# Altium project Sensor1.PrjPcb
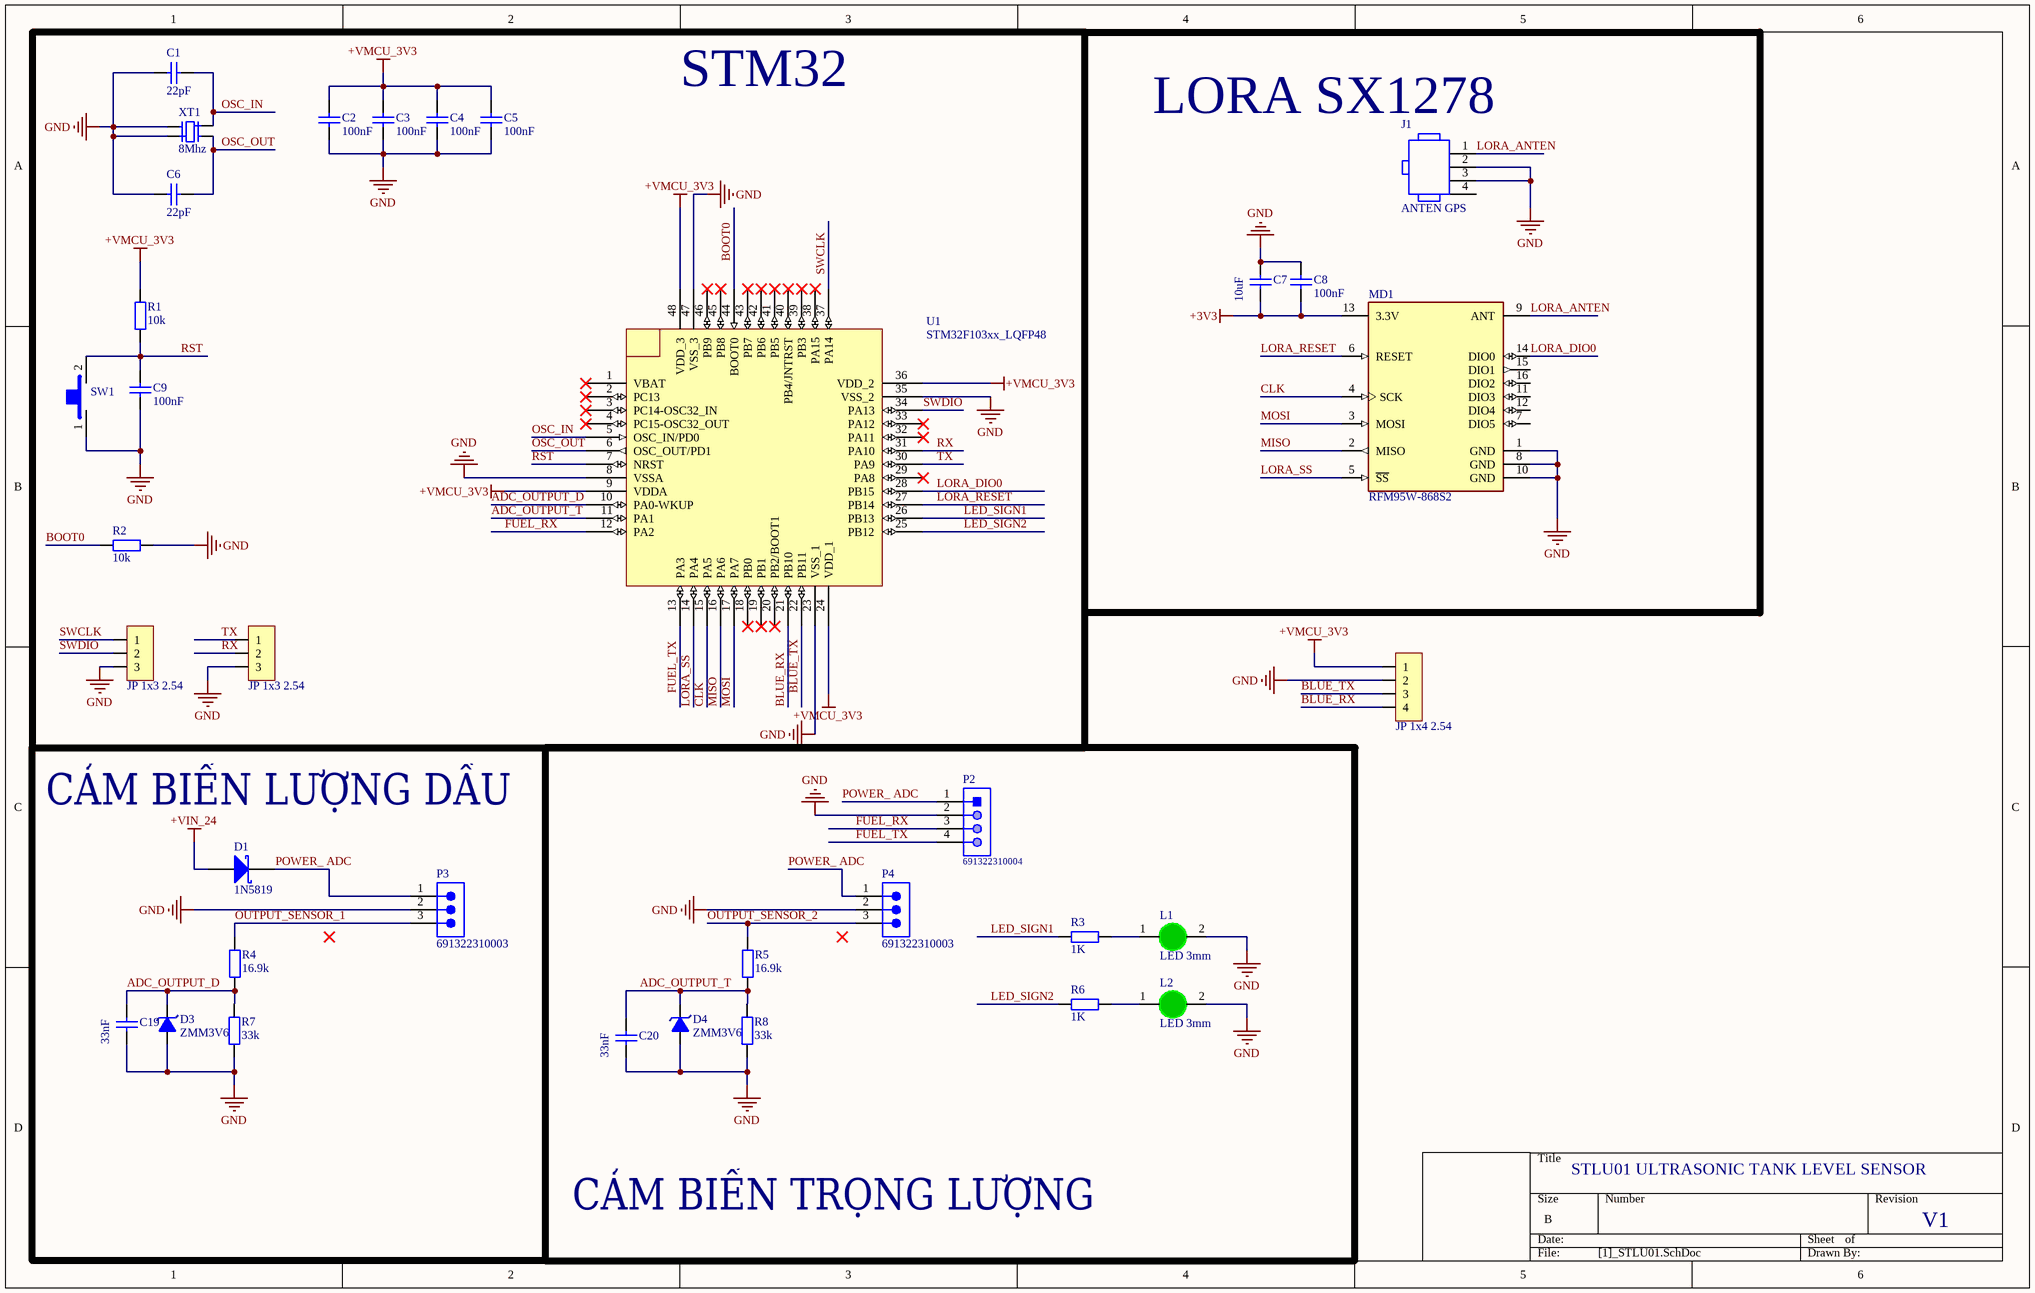
[diagram p0: [1]_STLU01.SchDoc]
2 sheets, 58 parts. Net scope: global (net labels, ports and power ports of the same name join across sheets).
Board file: PCB_Sensor1.PcbDoc
Sheets:
  [1]_STLU01.SchDoc
  [2]_Power.SchDoc

## Sheet [1]_STLU01.SchDoc
size B

### Parts
C1  22pF  [tu 0603]
C2  100nF  [tu 0603]
C3  100nF  [tu 0603]
C4  100nF  [tu 0603]
C5  100nF  [tu 0603]
C6  22pF  [tu 0603]
C7  10uF  [tu 0603]
C8  100nF  [tu 0603]
C9  100nF  [tu 0603]
C19  33nF  [tu 0603]
C20  33nF  [tu 0603]
D1  1N5819  [DO-214AA]
D3  ZMM3V6  [SOD_80]
D4  ZMM3V6  [SOD_80]
J1  ANTEN GPS  [TG-RECE-20369-001E-4_V]
JP1  JP 1x3 2.54  [JP 1x3 DT]
JP2  JP 1x3 2.54  [JP 1x3 DT]
JP3  JP 1x4 2.54  [JP 1x4 DT]
L1  LED 3mm  [LED-3MM-GREEN]
L2  LED 3mm  [LED-3MM-GREEN]
MD1  RFM95W-868S2  [FP-RFM95W-868S2-MFG]
P2  691322310004  [691322310004]
P3  691322310003  [691322310003]
P4  691322310003  [691322310003]
R1  10k  [tro smd 0603]
R2  10k  [tro smd 0603]
R3  1K  [tro smd 0805]
R4  16.9k  [tro smd 0805]
R5  16.9k  [tro smd 0805]
R6  1K  [tro smd 0805]
R7  33k  [tro smd 0805]
R8  33k  [tro smd 0805]
SW1  Tactile  [SW 2P SMD]  (value not drawn)
U1  STM32F103xx_LQFP48  [STM32_LQPF48]
XT1  8Mhz  [Thach Anh 4 chan 1]

### Blocks framed on the sheet
STM32: C1-C6 C9 JP1 JP2 R1 R2 SW1 U1 XT1
CẢM BIẾN LƯỢNG DẦU: C19 D1 D3 P3 R4 R7
CẢM BIẾN TRỌNG LƯỢNG: C20 D4 L1 L2 P2 P4 R3 R5 R6 R8

### Nets
+3V3: C7.2 C8.2 MD1.13(3.3V)
+VIN_24: D1.1(A)
+VMCU_3V3: C2.1 C3.1 C4.1 C5.1 JP3.1 R1.2 U1.9(VDDA) U1.24(VDD_1) U1.36(VDD_2) U1.48(VDD_3)
GND: C1.2 C2.2 C3.2 C4.2 C5.2 C6.2 C7.1 C8.1 C9.2 C19.2 C20.2 D3.1(A) D4.1(A) J1.2 J1.3 JP1.3 JP2.3 JP3.2 L1.2(K) L2.2(K) MD1.1(GND) MD1.8(GND) MD1.10(GND) P2.2 P3.2 P4.2 R2.1 R7.1 R8.1 SW1.1 U1.8(VSSA) U1.23(VSS_1) U1.35(VSS_2) U1.47(VSS_3) XT1.2 XT1.4
ADC_OUTPUT_D: C19.1 D3.2(K) R4.1 R7.2 U1.10(PA0-WKUP)
ADC_OUTPUT_T: C20.1 D4.2(K) R5.1 R8.2 U1.11(PA1)
BLUE_RX: JP3.4 U1.21(PB10)
BLUE_TX: JP3.3 U1.22(PB11)
BOOT0: R2.2 U1.44(BOOT0)
CLK: MD1.4(SCK) U1.15(PA5)
FUEL_RX: P2.3 U1.12(PA2)
FUEL_TX: P2.4 U1.13(PA3)
LED_SIGN1: R3.2 U1.26(PB13)
LED_SIGN2: R6.2 U1.25(PB12)
LORA_ANTEN: J1.1 MD1.9(ANT)
LORA_DIO0: MD1.14(DIO0) U1.28(PB15)
LORA_RESET: MD1.6(RESET) U1.27(PB14)
LORA_SS: MD1.5(~{SS}) U1.14(PA4)
MISO: MD1.2(MISO) U1.16(PA6)
MOSI: MD1.3(MOSI) U1.17(PA7)
OSC_IN: C1.1 U1.5(OSC_IN/PD0) XT1.3
OSC_OUT: C6.1 U1.6(OSC_OUT/PD1) XT1.1
OUTPUT_SENSOR_1: P3.3 R4.2
OUTPUT_SENSOR_2: P4.3 R5.2
POWER_ ADC: D1.2(K) P2.1 P3.1 P4.1
RST: C9.1 R1.1 SW1.2 U1.7(NRST)
RX: JP2.2 U1.31(PA10)
SWCLK: JP1.1 U1.37(PA14)
SWDIO: JP1.2 U1.34(PA13)
TX: JP2.1 U1.30(PA9)
NetL1_1: L1.1(A) R3.1
NetL2_1: L2.1(A) R6.1

Not connected (* = marked no-connect by the designer): J1 4; MD1 7(DIO5) 11(DIO3) 12(DIO4) 15(DIO1) 16(DIO2); U1 1(VBAT)* 2(PC13)* 3(PC14-OSC32_IN)* 4(PC15-OSC32_OUT)* 18(PB0)* 19(PB1)* 20(PB2/BOOT1)* 29(PA8)* 32(PA11)* 33(PA12)* 38(PA15)* 39(PB3)* 40(PB4/JNTRST)* 41(PB5)* 42(PB6)* 43(PB7)* 45(PB8)* 46(PB9)*

### Notes on the sheet
- (near J1) LORA SX1278
- STLU01 ULTRASONIC TANK LEVEL SENSOR
- V1

### Library data of the parts
C1 C6 = Tu 0603 101 50V 10%: Dán; Don_Vi: Con; So_Chan: 2; Ten_Linh_Kien: Tụ 0603 101-0.1nF 10% 50V; Ma_Hang: MH004565; Chung_Loai: Dán; Kieu_Chan: *
C2-C5 C8 = Tu 0603 104 50V 10%: Dán; Don_Vi: Con; So_Chan: 2; Ten_Linh_Kien: Tụ 0603 104-100nF 10% 50V; Ma_Hang: MH004568; Chung_Loai: Dán; Kieu_Chan: *
C7 C19 C20 = Tu 0603 105 16V 20%: Dán; Don_Vi: Con; So_Chan: 2; Ten_Linh_Kien: Tụ 0603 105-1uF 20% 16V; Ma_Hang: MH004574; Chung_Loai: Dán; Kieu_Chan: *
C9 = Tu 0603 105 50V 10%: Dán; Don_Vi: Con; So_Chan: 2; Ten_Linh_Kien: Tụ 0603 105-1uF 50V 10%; Ma_Hang: MH004569; Chung_Loai: Dán; Kieu_Chan: *
D1 = DIO_SS14: DIODE SCHOTTKY 1A 40V SMA DO-214AA; Manufacturer: Fairchild; Part number: SS14; Cost: 600; Package: DO-214AA; ComponentLink1Description: Link product; ComponentLink1URL: https://www.thegioiic.com/ss14-sma-diode-schottky-1a-1n5819
D3 D4 = DIO_ZMM3V6: ZMM3V6 3.6V 500mW SMD SOD-80; Manufacturer: On Semiconductor; Cost: 250; Part number: ZMM3V6; Package: SOD-80; ComponentLink1Description: Link product; ComponentLink1URL: https://www.thegioiic.com/zmm3v6-diode-zener-3-6v-500mw-smd
J1 = CMP-0275-00001-2: RF Connector, Onboard Receptacle, IPEX MHFIII; Manufacturer: Taoglas; PartNumber: RECE-20369-001E-01; Packing: Tape and Reel; Mounting Technology: Surface Mount; PackageReference: RECE-20369-001E-01-4; ComponentLink1URL: http://www.taoglas.com/; Housing Color: Gold; DatasheetVersion: Rev. C; ComponentLink2URL: http://www.taoglas.com/images/product_images/original_images/RECE.20369.001E.01.pdf; ComponentLink3Description: Package Specification; PackageVersion: Rev. C; ComponentLink1Description: Manufacturer URL; ComponentLink2Description: Datasheet; PackageDescription: 4-Pin, Hand Drawn, Body 1.7x1.7mm; ComponentLink3URL: http://www.taoglas.com/images/product_images/original_images/RECE.20369.001E.01.pdf
JP1 JP2 = JP 1x3 2.54 Duc Thang: Cắm; Ten_Linh_Kien: Jump Đơn Đực 2.54MM 1x40P Thẳng 11MM; Don_Vi: Con; Ma_Hang: MH000903; Ghi_Chu: *; Kieu_Chan: *; Chung_Loai: Cắm
JP3 = JP 1x4 2.54 Duc Thang: Cắm; Ten_Linh_Kien: Jump Đơn Đực 2.54MM 1x40P Thẳng 11MM; Don_Vi: Con; Ma_Hang: MH000903; Ghi_Chu: *; Kieu_Chan: *; Chung_Loai: Cắm
L1 L2 = LED 3mm Xanh La: Cắm; Don_Vi: Con; Ma_Hang: MH001054; Ten_Linh_Kien: Led 3MM Phủ Xanh (10c); Ghi_Chu: *; Kieu_Chan: *; Chung_Loai: Cắm
MD1 = CMP-204316-000001-1: RX TXRX MODULE ISM < 1GHZ SMD; Data Rate: 300Kbps; Frequency: 868MHz; Sensitivity: -123dBm; Interface: SPI; Current - Transmitting: 120mA; Current - Receiving: 12.1mA; Max Operating Temperature: 70°C; Case/Package: SMD/SMT; Packaging: Bulk; Mount: Surface Mount; Min Operating Temperature: -20°C
P2 = CMP-1502-01888-1: Serie 322 - 3.81mm Horizontal PCB Header WR-TBL, 4 pin; Manufacturer: Wurth Elektronik; Gender: Male; Pin Number: 4; Package Reference: 691322310004; Part Number: 691322310004; Publisher: WurthElektronik; Packaging: Box; Mounting Technology: THT; Manufacturer URL: http://www.we-online.de; Operating Temperature: -40to105degC; Pitch: 3.81mm; Datasheet URL: http://katalog.we-online.de/em/datasheet/6913223100xx.pdf
P3 P4 = CMP-1502-01887-2: NexarPartId: 8917778; Pitch: 3.81mm; Number of Positions Per Level: 3; Current: 10A; Voltage: 300V; Number of Levels: 1; Gender: Male; Termination: Solder; Number of Rows: 1; Contact Plating: Tin; Packaging: Box; Height: 9.2mm; Mount: Through Hole; Number of Contacts: 3; Width: 12.82mm; Lead Pitch: 3.81mm; REACH SVHC: Unknown; RoHS: Compliant; Length: 10.5mm; Number of Pins: 3; Color: Green; Contact Material: Brass
R1 R2 = Tro 0603 5% 10k: Dán; Don_Vi: Con; So_Chan: 2; Ten_Linh_Kien: Trở 0603 5% 10k; Ma_Hang: MH006316; Chung_Loai: Dán; Kieu_Chan: *
R3-R8 = Tro 0805 5% 1k: Dán; Don_Vi: Con; So_Chan: 2; Ten_Linh_Kien: Trở 0805 5% 1k; Ma_Hang: MH005234; Chung_Loai: Dán; Kieu_Chan: *
SW1 = SW_SPDT_2PIN: SMD Mini Push Button Switch 2 Pin 3x6x2.7mm; Manufacturer: OEM; Part number: SPST 2 PIN SMD; Cost: 600; ComponentLink1Description: Link product; ComponentLink1URL: https://www.thegioiic.com/nut-nhan-3-5x6mm-cao-2-5mm-2-chan-smd-dau-trang
XT1 = Thach Anh 4 Chan SMD: Crystal For all Crystal 2pin.; Value: 4Mhz
U1 = STM32F103xx_LQFP48: Published: 30-May-2008; DatasheetVersion: rev6, Mar-2008; PackageVersion: Mar-2008; PackageReference: LQFP48; Publisher: Altium Limited; PackageDescription: 48-Pin Low-Profile Quad Flat Pack, 7 x 7 mm Body, 0.5 mm Pitch (LQFP48); ComponentLink1Description: Manufacturer Link; ComponentLink1URL: www.st.com/stm32; ComponentLink2Description: Datasheet; ComponentLink2URL: http://www.st.com/stonline/products/literature/ds/13587.pdf

## Sheet [2]_Power.SchDoc
size B
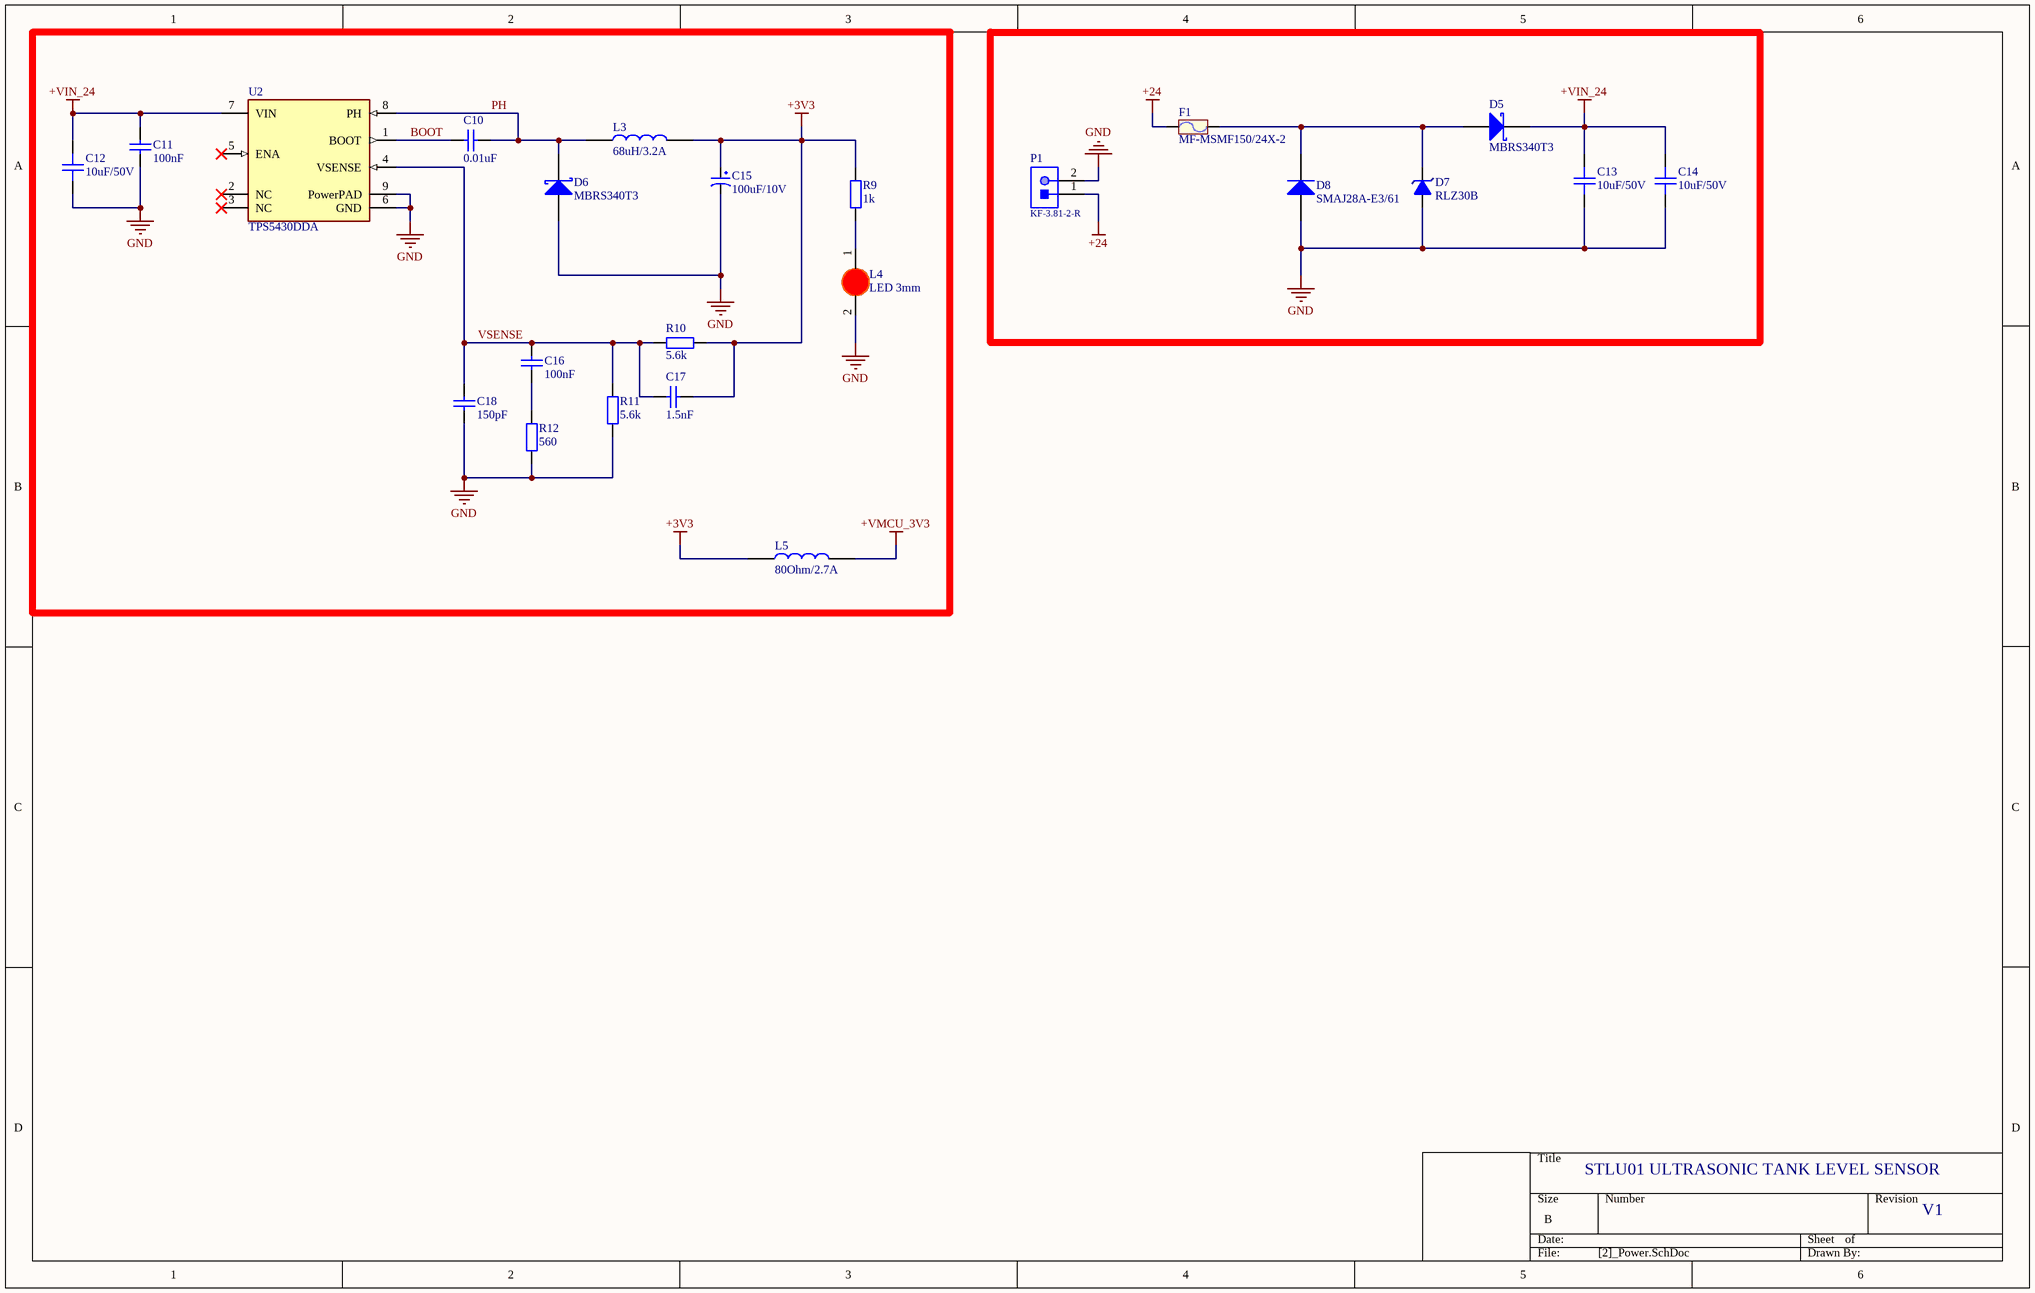
[diagram p1: [2]_Power.SchDoc]

### Parts
C10  0.01uF  [tu 0603]
C11  100nF  [tu 0805]
C12  10uF/50V  [1210]
C13  10uF/50V  [1210]
C14  10uF/50V  [1210]
C15  100uF/10V  [2312]
C16  100nF  [tu 0805]
C17  1.5nF  [tu 0805]
C18  150pF  [tu 0805]
D5  MBRS340T3  [DO214AB_SMC]
D6  MBRS340T3  [DO214AB_SMC]
D7  RLZ30B  [SOD_80]
D8  SMAJ28A-E3/61  [VISH-DO-214AC-2_L]
F1  MF-MSMF150/24X-2  [1812]
L3  68uH/3.2A  [IND-12_12_8]
L4  LED 3mm  [LED-3MM-RED]
L5  80Ohm/2.7A  [FER-0805 (2012)]
P1  KF-3.81-2-R  [691322310002]
R9  1k  [tro smd 0805]
R10  5.6k  [tro smd 0805]
R11  5.6k  [tro smd 0805]
R12  560  [tro smd 0805]
U2  TPS5430DDA  [FP-DDA0008J-MFG]

### Nets
+3V3: C15.1 C17.2 L3.2 L5.1 R9.2 R10.1
+24: F1.1 P1.1
+VIN_24: C11.1 C12.2 C13.2 C14.2 D5.2(K) U2.7(VIN)
+VMCU_3V3: L5.2
GND: C11.2 C12.1 C13.1 C14.1 C15.2 C18.2 D6.1(A) D7.1(A) D8.2(A) L4.2(K) P1.2 R11.1 R12.1 U2.6(GND) U2.9(PowerPAD)
BOOT: C10.2 U2.1(BOOT)
PH: C10.1 D6.2(K) L3.1 U2.8(PH)
VSENSE: C16.1 C17.1 C18.1 R10.2 R11.2 U2.4(VSENSE)
NetC16_2: C16.2 R12.2
NetD5_1: D5.1(A) D7.2(K) D8.1(K) F1.2
NetL4_1: L4.1(A) R9.1

Not connected (* = marked no-connect by the designer): U2 2(NC)* 3(NC)* 5(ENA)*

### Notes on the sheet
- STLU01 ULTRASONIC TANK LEVEL SENSOR
- V1

### Library data of the parts
C10 = Tu 0603 105 16V 20%: as C7 on sheet [1]_STLU01; Chung_Loai: Dán; Kieu_Chan: *
C11 C16-C18 = Tu 0805 10pF 50V 10%: Dán; Don_Vi: Con; So_Chan: 2; Ten_Linh_Kien: Tụ 0805 10P 10% 50V; Ma_Hang: MH004554; Chung_Loai: Dán; Kieu_Chan: *
  C17 C18: ComponentLink1Description: New link; ComponentLink1URL: https://www.thegioiic.com/tu-gom-0805-150pf-50v
C12-C14 = CAP_CER_1210_10uF: CAP CER 10uF/50V 1210; Manufacturer: Yageo; Part number: C1210; Cost: 3400; ComponentLink1Description: Link product; ComponentLink1URL: https://www.thegioiic.com/tu-gom-1210-10uf-50v; Package: 1210
C15 = CAP_TANT_2312_100uF: CAP TANT 100uF/10V 2312; Manufacturer: AVX; Part number: TAJC107K010RNJ; Cost: 5000; ComponentLink1Description: Link product; ComponentLink1URL: https://www.thegioiic.com/tu-tantalum-100uf-10v-2312-tajc107k010rnj; Package: 2312
D5 D6 = DIO_MBRS340T3: DIODE SCHOTTKY 4A 40V SMC DO-214AB; Manufacturer: Fairchild; Part number: SS14; Cost: 2000; Package: DO-214AB; ComponentLink1Description: Link product; ComponentLink1URL: https://www.thegioiic.com/mbrs340t3-diode-schottky-4a
D7 = DIO_ZMM15: ZMM15 15V 500mW SMD SOD-80; Manufacturer: On Semiconductor; Cost: 250; Part number: ZMM15; Package: SOD-80 2L; ComponentLink1Description: Link product; ComponentLink1URL: https://www.thegioiic.com/rlz30b-diode-zener-27-70-29-13v-500mw-smd
D8 = CMP-0548-00227-2: Transient Voltage Suppressor, 6.40 to 231 V, 28 V Stand-off Voltage, Uni-Directional, -55 to 155 degC, 2-pin DO-214AC, Pb-Free, Tape and Reel; Manufacturer: Vishay Semiconductor; IFSM: 40 A; VBR Uni-Directional (V): 6.4 to 231; ID (uA): 1; VWM (V): 28; PPPM (W): 400, 300; PackageReference: DO-214AC-2; Packing: Tape and Reel; RoHS: TRUE; PartNumber: SMAJ28A-E3/61; PackageDescription: 2-Pin DO-214AC (SMA), Body 4.245 x 2.665 mm; Mounting Technology: Surface Mount; DatasheetVersion: 12/8/2013; Operating Junction and Storage Temperature Range: -55 to 150 degC; ComponentLink4Description: New link; ComponentLink4URL: https://www.thegioiic.com/smaj28a-e3-61-tvs-diode-28v-45-4v-do214ac
F1 = FUSE_16V_2.5A: MF-MSMF250/16 16V 2.5A1812; Manufacturer: Bourns; Cost: 3000; Part number: 1812; ComponentLink1Description: Link product; ComponentLink1URL: https://www.thegioiic.com/mf-msmf150-24x-2-cau-chi-tu-phuc-hoi-1812-24v-1-5a; Package: 1812
L3 = IND_68uH_3.2A_1280: CDRH127 IND 68uH 3.2A 12x12x8; Manufacturer: OEM; Cost: 3200; Part number: CDRH127; Package: 1280; ComponentLink1Description: Link product; ComponentLink1URL: https://www.thegioiic.com/cdrh127-cuon-cam-dan-smd-1280-680-68uh-3-2a
L4 = LED 3mm Do: Cắm; Don_Vi: Con; Ma_Hang: MH003892; Ten_Linh_Kien: Led 3MM Phủ Đỏ (10c); Ghi_Chu: *; Kieu_Chan: *; Chung_Loai: Cắm
L5 = FERRITE_BEAD_2.7A_80: FERRITE BEAD 2.7A 80 OHM 0805; Manufacturer: Taiyo Yuden; Part number: FBMH2012HM800-T; Cost: 2000; Package: 0805; ComponentLink1Description: Link product; ComponentLink1URL: https://www.thegioiic.com/fbmh2012hm800-t-ferrite-bead-80-ohm-0805
P1 = CMP-1502-01886-1: Serie 322 - 3.81mm Horizontal PCB Header WR-TBL, 2 pin; Manufacturer: Wurth Elektronik; Gender: Male; Pin Number: 2; Publisher: WurthElektronik; Pitch: 3.81mm; Packaging: Box; Part Number: 691322310002; Manufacturer URL: http://www.we-online.de; Operating Temperature: -40to105degC; Mounting Technology: THT; Datasheet URL: http://katalog.we-online.de/em/datasheet/6913223100xx.pdf; Package Reference: 691322310002
R9-R12 = Tro 0805 1% 5.1k: Dán; Don_Vi: Con; So_Chan: 2; Ten_Linh_Kien: Trở 0805 1% 5.1k; Ma_Hang: MH008812; Chung_Loai: Dán; Kieu_Chan: *
U2 = CMP-2000-04960-2: IC REG BUCK ADJUSTABLE 3A 8SOPWR; Manufacturer: Texas Instruments; Max Junction Temp: +125°C; Max Supply Voltage: 36V; Switching Frequency: 500kHz; Output Type: AdjustableProgrammable; Standoff Height: 0mm; Output Voltage: 1.23-31V; Max Duty Cycle: 89%; Nominal Supply Current: 3mA; Min Supply Voltage: 5.5V; Number Of Outputs: 1; Temperature: -40°C to +125°C; Temperature Range High: +125°C; Manufacturer Part Number: TPS5430DDA; Device Class L3: Voltage Regulators - Switching; Mouser Description: Voltage Regulators - Switching Regulators 5.5 to 36V Input 3A Step Dwn Converter; Switching Topology: Buck; ComponentLink2URL: http://www.ti.com/lit/ds/symlink/tps5431.pdf; ComponentLink2Description: Datasheet; Device Class L2: Power Management ICs; Device Class L1: Integrated Circuits (ICs); Digikey Description: IC REG BUCK ADJUSTABLE 3A 8SOPWR; RoHS: TRUE; Octopart: https://octopart.com/tps5430dda-texas+instruments-589977; Output Current: 3A; Automotive: No; Lead Free: Yes; Category: IC; Package: DDA0008J; Temperature Range Low: -40°C; Height: 1.7mm

## Nets that join several sheets
+3V3: [1]_STLU01 (C7.2 C8.2 MD1.13), [2]_Power (6 pins)
+VIN_24: [1]_STLU01 (D1.1), [2]_Power (6 pins)
+VMCU_3V3: [1]_STLU01 (10 pins), [2]_Power (L5.2)
GND: [1]_STLU01 (36 pins), [2]_Power (15 pins)